# Altium schematic sheet UHVMonitoring.SchDoc
size A
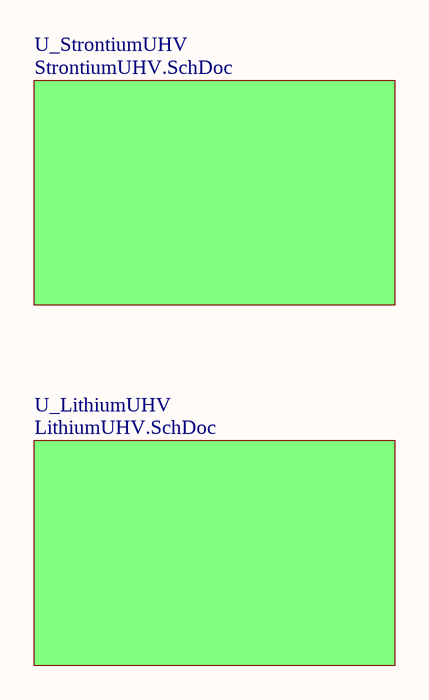
[diagram p0: UHVMonitoring.SchDoc]

## Sub-sheets
U_LithiumUHV = LithiumUHV.SchDoc: no entries
U_StrontiumUHV = StrontiumUHV.SchDoc: no entries